# EAGLE design node_td (EAGLE 6.4)
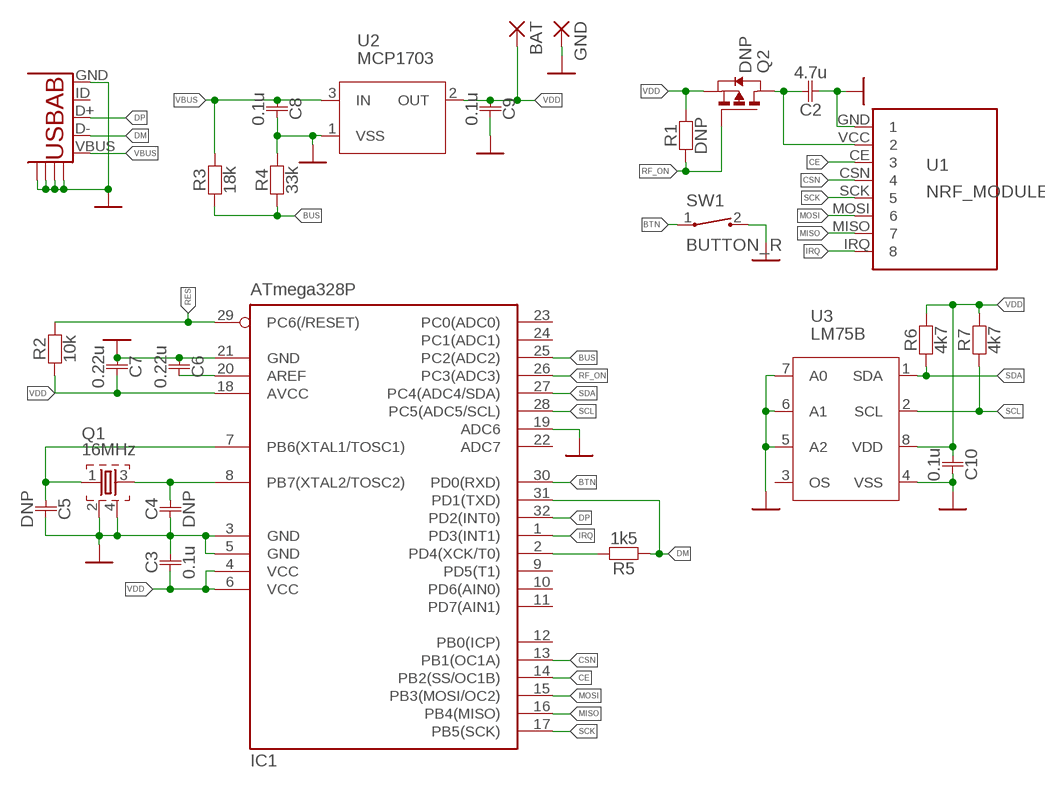
[diagram p0: schematic, sheet 1]

## Parts
BAT  WIREPAD1,6/0,9  [1,6/0,9]
C2  4.7u  C0805  [0805]
C3  0.1u  C0402  [0402]
C4  DNP  C0402  [0402]
C5  DNP  C0402  [0402]
C6  0.22u  C0402  [0402]
C7  0.22u  C0402  [0402]
C8  0.1u  C0402  [0402]
C9  0.1u  C0402  [0402]
C10  0.1u  C0402  [0402]
GND  WIREPAD1,6/0,9  [1,6/0,9]
IC1  ATmega328P  MEGA8-AI  [TQFP32-08]
Q1  16MHz  FA-3225  [FA-20H]
Q2  DNP  P-CHANNEL  [SOT23]
R1  DNP  R0402  [0402]
R2  10k  R0402  [0402]
R3  18k  R0402  [0402]
R4  33k  R0402  [0402]
R5  1k5  R0402  [0402]
R6  4k7  R0402  [0402]
R7  4k7  R0402  [0402]
SW1  BUTTON_R  [BUTTON_1]
U1  NRF_MODULE  [NRF_MODULE]
U2  MCP1703  [SOT23]
U3  LM75B  LM75DP  [MSOP8]
U$1  UNTITLED_USB_AB  [USB-MICRO-MOD]

## Nets
BTN: IC1.30(PD0(RXD)) SW1.1
BUS: IC1.25(PC2(ADC2)) R3.P$1 R4.P$1
CE: IC1.14(PB2(SS/OC1B)) U1.CE
CSN: IC1.13(PB1(OC1A)) U1.CSN
DM: IC1.31(PD1(TXD)) R5.P$1 U$1.D-
DP: IC1.32(PD2(INT0)) U$1.D+
GND: C2.P$1 C3.P$2 C4.P$1 C5.P$2 C6.P$1 C7.P$1 C8.P$2 C9.P$2 C10.P$2 GND.1(P) IC1.3(GND) IC1.5(GND) IC1.19(ADC6) IC1.21(GND) Q1.2 Q1.4 R4.P$2 SW1.2 U1.GND U2.1(VSS) U3.4(VSS) U3.5(A2) U3.6(A1) U3.7(A0) U$1.GND U$1.GND@1 U$1.GND@2 U$1.GND@3 U$1.GND@4
IRQ: IC1.1(PD3(INT1)) U1.IRQ
MISO: IC1.16(PB4(MISO)) U1.MISO
MOSI: IC1.15(PB3(MOSI/OC2)) U1.MOSI
N$1: IC1.2(PD4(XCK/T0)) R5.P$2
N$2: C6.P$2 IC1.20(AREF)
N$3: C5.P$1 IC1.7(PB6(XTAL1/TOSC1)) Q1.1
N$4: C4.P$2 IC1.8(PB7(XTAL2/TOSC2)) Q1.3
N$7: C2.P$2 Q2.3(D) U1.VCC
RES: IC1.29(PC6(/RESET)) R2.P$2
RF_ON: IC1.26(PC3(ADC3)) Q2.1(G) R1.P$1
SCK: IC1.17(PB5(SCK)) U1.SCK
SCL: IC1.28(PC5(ADC5/SCL)) R7.P$1 U3.2(SCL)
SDA: IC1.27(PC4(ADC4/SDA)) R6.P$1 U3.1(SDA)
VBUS: C8.P$1 R3.P$2 U2.3(IN) U$1.VBUS
VDD: BAT.1(P) C3.P$1 C7.P$2 C9.P$1 C10.P$1 IC1.4(VCC) IC1.6(VCC) IC1.18(AVCC) Q2.2(S) R1.P$2 R2.P$1 R6.P$2 R7.P$2 U2.2(OUT) U3.8(VDD)
Unconnected: IC1.9(PD5(T1)) IC1.10(PD6(AIN0)) IC1.11(PD7(AIN1)) IC1.12(PB0(ICP)) IC1.22(ADC7) IC1.23(PC0(ADC0)) IC1.24(PC1(ADC1)) U3.3(OS) U$1.ID(USBID)

## Library data of the parts
BAT GND = wirepad:WIREPAD: Wire PAD connect wire on PCB
C2-C10 = copter:C
IC1 = atmel:MEGA8: MICROCONTROLLER 8 Kbytes FLASH, 1 kbytes SRAM, 512 bytes EEPROM, USART, 6-channel 10 bit ADC, 2-channel 8 bit ADC Pin compatible with Atmega48, ATMega88, ATMega168 Source: avr.lbr; MPN: ATMEGA8-16AU; OC_FARNELL: 9171371; OC_NEWARK: 73M8863
Q1 = RLC:FA-: MHz RANGE CRYSTAL UNIT Source: Epson Toyocom
Q2 = cm-a20:P-CHANNEL
R1-R7 = copter:R
SW1 = RLC:BUTTON: CT10 Series Molded Switch Source: www.cotorelay.com .. Coto_Technology__CT10-1530-G1.pdf
U1 = nrf24L01:NRF_MODULE
U2 = thermo:MCP1703
U3 = thermo:LM75
U$1 = lb:UNTITLED_USB_AB: This is a USB AB connector that is compatible with USB OTG. i.e. this connector can serve as a host or device

## Board
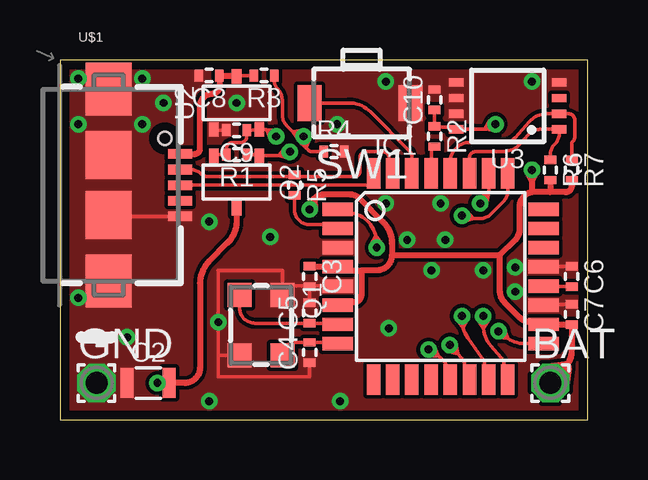
[diagram p1: board, top side]
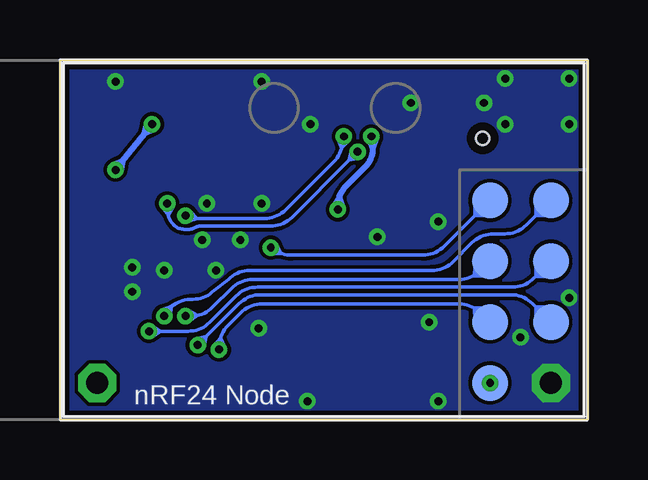
[diagram p2: board, bottom side, seen from below]

Size 22 x 15 mm. Coordinates in mm from the lower left corner, seen from the top.
Outline: 0,0 22,0 22,15 0,15 0,0
Copper layers (1*16): Top 0.0356mm / dielectric 1.5011mm / Bottom 0.0356mm
Design rules "oshpark-2layer": minimum track width 6mil, minimum drill 13mil, track to track 6mil, track to pad 6mil, pad to pad 6mil, via to via 6mil, smd to smd 6mil, copper to edge 15mil, drill to drill 6mil, minimum pad ring 7mil, minimum via ring 7mil, stop-mask expansion 0mil, vias tented up to drill 30mil, thermal gap 10mil

### Footprints (pad centres in the part's own frame; a part is rotated, then mirrored left to right if it is on the bottom)
1,6/0,9 = drill 0.914 pad 1.6 octagon: 1 0,0
0805 = smd 0.55 x 1.25: P$1 -0.875,0; P$2 0.875,0
0402 = smd 0.35 x 0.5: P$1 -0.425,0; P$2 0.425,0
TQFP32-08 = smd 1.27 x 0.559: 1 -4.293,2.8; 2 -4.293,2; 3 -4.293,1.2; 4 -4.293,0.4; 5 -4.293,-0.4; 6 -4.293,-1.2; 7 -4.293,-2; 8 -4.293,-2.8; 17 4.293,-2.8; 18 4.293,-2; 19 4.293,-1.2; 20 4.293,-0.4; 21 4.293,0.4; 22 4.293,1.2; 23 4.293,2; 24 4.293,2.8 | smd 0.559 x 1.27: 9 -2.8,-4.293; 10 -2,-4.293; 11 -1.2,-4.293; 12 -0.4,-4.293; 13 0.4,-4.293; 14 1.2,-4.293; 15 2,-4.293; 16 2.8,-4.293; 25 2.8,4.293; 26 2,4.293; 27 1.2,4.293; 28 0.4,4.293; 29 -0.4,4.293; 30 -1.2,4.293; 31 -2,4.293; 32 -2.8,4.293
FA-20H = smd 1 x 1: 1 -1.27,-0.889; 2 1.27,-0.889; 3 1.27,0.889; 4 -1.27,0.889
SOT23 = smd 0.4 x 0.6: 1 -0.95,-1.1; 2 0.95,-1.1; 3 0,1.1
BUTTON_1 = smd 1 x 1.5: 1 -2.159,0; 2 2.032,0
NRF_MODULE = smd 1.5 x 1.5: CE -1.524,4.064; CSN -4.064,4.064; GND -1.524,1.524; IRQ -4.064,9.144; MISO -1.524,9.144; MOSI -4.064,6.604; SCK -1.524,6.604; VCC -4.064,1.524
MSOP8 = smd 0.35 x 0.6: 1 -0.975,-2.152; 2 -0.325,-2.152; 3 0.325,-2.152; 4 0.975,-2.152; 5 0.975,2.152; 6 0.325,2.152; 7 -0.325,2.152; 8 -0.975,2.152
USB-MICRO-MOD = smd 1 x 0.4: D+ 2.469,0; D- 2.469,0.65; GND 2.469,-1.3; ID 2.469,-0.65; VBUS 2.469,1.3 | smd 1.9 x 2.2: GND@1 -0.508,4; GND@4 -0.508,-4 | smd 1.9 x 2: GND@2 -0.508,1.25; GND@3 -0.508,-1.25 | hole 0.55: 1.84,1.95

### Placement (x,y rotation side)
BAT  20.45,1.52 0 top
C2  3.68,1.52 0 top
C3  10.41,5.97 270 top
C4  10.41,2.79 90 top
C5  10.41,4.45 90 top
C6  21.34,5.97 270 top
C7  21.34,4.38 270 top
C8  6.22,14.35 180 top
C9  7.37,12.06 180 top
C10  15.62,13.34 90 top
GND  1.52,1.52 0 top
IC1  15.88,5.97 0 top
Q1  8.38,3.94 270 top
Q2  7.37,9.91 180 top
R1  7.37,11.05 180 top
R2  15.62,11.81 270 top
R3  8.51,14.35 180 top
R4  11.43,11.18 0 top
R5  9.78,9.78 270 top
R6  20.45,10.41 270 top
R7  21.34,10.41 270 top
SW1  12.57,13.21 0 top
U1  0,0 0 bottom
U2  7.37,13.21 0 top
U3  18.67,13.08 90 top
U$1  2.54,9.78 0 top

### Tracks (layer width: path | path; a pad name or v marks a point on that pad's centre or on a via)
BTN
  Top 0.152: SW1.1 12.05,13.21 arc-45 12.95,12.84 14.58,11.2 arc-45 14.68,10.97 IC1.30
BUS  (via drill 0.33 pad 0.53)
  Top 0.152: R3.P$1 8.93,14.14 arc45 9.09,13.78 arc-45 9.27,13.33 9.27,12.71 arc45 9.46,12.26 9.71,12.01 | 9.71,12.01 9.91,11.81 v10.16,11.81 | R4.P$1 10.52,11.18 arc-45 10.34,11.25 10.26,11.33 | 10.26,11.33 10.23,11.36 arc-45 10.16,11.54 v10.16,11.81 | IC1.25 18.68,9.54 arc-45 18.49,9.09 17.97,8.57 arc-45 17.52,8.38 17.24,8.38 | 17.24,8.38 16.89,8.38 v16.76,8.51 | 9.71,12.01 9.94,11.66 v10.16,11.81 | 9.71,12.01 10.12,12.07 v10.16,11.81 | 10.26,11.33 10.41,11.72 v10.16,11.81 | 10.26,11.33 9.97,11.62 v10.16,11.81 | 17.24,8.38 16.96,8.69 v16.76,8.51 | 17.24,8.38 16.84,8.26 v16.76,8.51
  Bottom 0.152: v16.76,8.51 16.64,8.38 16.29,8.38 | 16.29,8.38 13.48,8.38 arc-45 12.58,8.75 10.6,10.74 arc-45 10.22,11.64 10.22,11.75 v10.16,11.81 | v10.16,11.81 10.41,11.72 10.26,11.33 9.97,11.62 v10.16,11.81 | 16.29,8.38 16.68,8.26 v16.76,8.51 | 16.29,8.38 16.57,8.69 v16.76,8.51
CE  (via drill 0.33 pad 0.53)
  Top 0.152: IC1.14 16.89,1.68 16.89,2.17 arc42 16.73,2.6 16.59,2.75 | 16.59,2.75 v16.26,3.11 | 16.59,2.75 16.52,3.16 v16.26,3.11 | 16.59,2.75 16.19,2.85 v16.26,3.11
  Bottom 0.152: U1.CE 2.16,4.7 | 2.16,4.7 2.29,4.83 arc-45 3.19,5.21 13.63,5.21 arc-45 14.53,4.83 15.91,3.46 | 15.91,3.46 v16.26,3.11 | 15.91,3.46 16,3.05 v16.26,3.11 | 15.91,3.46 16.31,3.37 v16.26,3.11 | 2.16,4.7 1.65,4.7 2.16,4.19 2.16,4.7
CSN  (via drill 0.33 pad 0.53)
  Top 0.152: IC1.13 16.13,1.82 16.13,2.07 arc56 15.85,2.6 v15.37,2.92 | v15.37,2.92 15.61,3.03 15.78,2.65 15.36,2.65 v15.37,2.92
  Bottom 0.152: U1.CSN 4.45,4.45 | 4.45,4.45 arc-45 5.35,4.83 13.57,4.83 arc-45 14.47,4.45 14.99,3.93 arc-45 15.37,3.03 v15.37,2.92 | v15.37,2.92 15.13,3.04 15.31,3.41 15.57,3.09 v15.37,2.92 | 4.45,4.45 4.7,4.14 4.72,4.65 4.17,4.67 4.34,4.37
DM
  Top 0.152: IC1.31 13.72,10.26 13.72,10.92 arc90 13.46,11.18 12.76,11.18 arc90 12.51,10.92 12.51,10.35 arc-90 12.3,10.14 9.65,10.14 | 9.65,10.14 R5.P$1 | 9.65,10.14 6.13,10.14 arc-45 5.89,10.24 arc45 5.44,10.43 U$1.D-
DP
  Top 0.152: U$1.D+ 13.07,9.78 IC1.32
GND  (via drill 0.33 pad 0.53)
  Top 0.152: C9.P$2 6.46,12.06 arc-90 U2.1 | IC1.5 10.41,5.57 | 10.41,5.57 C3.P$2 C5.P$2 | 10.41,5.57 9.27,5.57 Q1.4 9.27,6.22 6.6,6.22 6.6,2.67 | C6.P$1 20.17,6.39 | 20.17,6.39 IC1.21 | 20.17,6.39 20.12,6.35 | C7.P$1 20.17,4.81 IC1.19 | 6.6,2.67 6.6,1.78 10.41,1.78 C4.P$1 | Q1.2 6.6,2.67 | U$1.GND 2.08,8.48 U$1.GND@3
  other vias: 17.65,6.22 7.37,13.21 4.32,13.21 19.68,14.1 13.59,14.1 11.68,0.76 6.22,0.76 0.76,14.22 3.43,14.22 3.43,12.32 0.76,12.32 2.79,3.43 0.76,5.08 11.56,12.32 18.99,5.33 18.99,6.35 13.59,9.02 15.88,9.02 14.48,7.49 16.07,7.49 15.49,6.22 6.6,4.06 6.22,8.26 8.76,7.62 13.72,3.81
  pour Bottom (rank 6, no thermals): 0.13,14.86 21.84,14.86 21.84,0.13 0.13,0.13
  pour Top (no thermals): 0.13,14.86 21.84,14.86 21.84,0.13 0.13,0.13
IRQ  (via drill 0.33 pad 0.53)
  Top 0.152: IC1.1 11.71,8.64 11.94,8.64 arc-90 13.21,7.37 v13.21,7.18 | v13.21,7.18 12.97,7.3 13.17,7.67 13.42,7.33 v13.21,7.18
  Bottom 0.152: U1.IRQ 4.7,8.51 | 4.7,8.51 5.98,7.23 arc45 6.88,6.86 12.34,6.86 arc32 13.01,7.05 v13.21,7.18 | v13.21,7.18 13.19,6.91 12.77,6.94 12.97,7.3 v13.21,7.18 | 4.7,8.51 4.7,9.02 arc270 4.19,8.51 4.7,8.51
MISO  (via drill 0.33 pad 0.53)
  Top 0.152: IC1.16 18.54,1.68 18.54,2.17 arc41 18.39,2.59 17.97,3.07 arc-41 17.65,3.91 v17.65,4.32 | v17.65,4.32 17.88,4.18 17.66,3.82 17.43,4.17 v17.65,4.32
  Bottom 0.152: U1.MISO 2.16,8.51 | 2.16,8.51 2.55,8.12 arc45 3.45,7.75 3.92,7.75 arc-45 4.82,7.38 5.6,6.59 arc45 6.5,6.22 14.08,6.22 arc-45 14.98,5.85 15.57,5.39 arc45 16.46,5.02 16.55,5.02 arc-34 17.36,4.72 | v17.65,4.32 17.58,4.52 arc11 17.36,4.72 | 17.36,4.72 17.39,4.3 v17.65,4.32 | 17.36,4.72 17.75,4.57 v17.65,4.32 | 2.16,8.51 1.52,8.51 arc-217 2.16,9.02 2.16,8.51
MOSI  (via drill 0.33 pad 0.53)
  Top 0.152: IC1.15 17.72,1.68 17.72,2.21 arc36 17.6,2.58 17,3.42 arc-36 16.76,4.15 v16.76,4.32 | v16.76,4.32 17,4.2 16.81,3.83 16.55,4.16 v16.76,4.32
  Bottom 0.152: U1.MOSI 4.45,6.21 | 4.45,6.21 arc45 5.35,5.84 13.95,5.84 arc-45 14.85,5.47 15.63,4.69 arc45 16.53,4.32 v16.76,4.32 | v16.76,4.32 16.61,4.1 16.27,4.34 16.63,4.55 v16.76,4.32 | 4.45,6.21 4.24,5.97 4.75,5.99 4.67,6.4
N$1
  Top 0.152: IC1.2 11.42,8.13 10.41,8.13 arc-90 9.78,8.76 R5.P$2
N$2
  Top 0.152: C6.P$2 20.17,5.54 IC1.20
N$3
  Top 0.152: IC1.7 11.58,4.02 C5.P$1 8.13,4.02 arc-90 7.49,4.66 Q1.1
N$4
  Top 0.152: IC1.8 11.58,3.22 C4.P$2 9.82,3.22 arc90 Q1.3
N$7  (via drill 0.33 pad 0.53)
  Top 0.152: C2.P$2 4.56,1.54
  Top 0.254: Q2.3 7.37,8.27 arc-45 6.99,7.38 6.21,6.59 arc45 5.84,5.7 5.84,2.17 arc-45 5.66,1.72 5.65,1.71 arc-45 5.2,1.52 C2.P$2 | C2.P$2 | 4.56,1.54 U1.VCC | C2.P$2 4.16,1.72 U1.VCC | C2.P$2 4.16,1.33 U1.VCC
  other vias: 4.06,1.52
RES
  Top 0.152: R2.P$2 15.49,11.26 15.49,10.26 IC1.29
RF_ON  (via drill 0.33 pad 0.53)
  Top 0.152: R1.P$1 8.32,11.05 Q2.1 9.12,11.01 | 9.12,11.01 9.31,11.01 arc45 9.49,11.08 v9.59,11.18 | IC1.26 17.88,9.5 arc-45 17.78,9.27 v17.53,9.02 | 9.12,11.01 9.53,10.92 v9.59,11.18 | 9.12,11.01 9.38,11.34 v9.59,11.18 | v17.53,9.02 17.45,9.27 17.86,9.39 17.79,8.97 v17.53,9.02
  Bottom 0.152: v17.53,9.02 17.53,8.8 arc-16 17.49,8.52 | 17.49,8.52 arc-29 17.23,8.09 17.27,8.12 arc-45 16.82,7.94 16.59,7.94 arc-27 16.44,7.97 16.32,8.03 arc27 16.18,8.06 13.23,8.06 arc-45 12.33,8.44 9.94,10.83 | 9.94,10.83 v9.59,11.18 | 9.94,10.83 9.85,11.23 v9.59,11.18 | 9.94,10.83 9.53,10.92 v9.59,11.18 | 17.49,8.52 17.74,8.86 v17.53,9.02 | 17.49,8.52 17.29,8.89 v17.53,9.02
SCK  (via drill 0.33 pad 0.53)
  Top 0.152: v18.29,3.68 18.58,3.45 arc39 19.38,3.17 IC1.17 | v18.29,3.68 18.54,3.77 18.68,3.38 18.26,3.42 v18.29,3.68
  Bottom 0.152: U1.SCK 2.16,5.97 | 2.16,5.97 2.23,5.9 arc45 3.13,5.52 13.76,5.52 arc-45 14.66,5.15 15.76,4.05 arc45 16.66,3.68 17.79,3.68 | v18.29,3.68 17.79,3.68 | 17.79,3.68 18.14,3.46 v18.29,3.68 | 17.79,3.68 18.14,3.91 v18.29,3.68 | 2.16,5.97 1.65,5.97 2.16,6.48 2.16,5.97
SCL
  Top 0.152: R7.P$1 21.34,11.48 arc-45 21.39,11.61 arc45 21.46,11.79 21.46,12.5 arc90 21.21,12.76 U3.2 20.32,12.76 arc48 19.57,12.42 18.98,11.77 arc-48 18.51,11.56 17.03,11.56 arc45 16.58,11.37 16.46,11.25 arc45 16.27,10.8 IC1.28
SDA
  Top 0.152: R6.P$1 20.45,11.04 arc-45 20.63,11.49 20.64,11.5 arc45 20.83,11.95 20.83,11.97 U3.1 20.02,12.11 arc49 19.54,11.89 19.22,11.52 arc-49 18.46,11.18 17.33,11.18 arc90 17.07,10.92 IC1.27
VBUS
  Top 0.152: R3.P$2 7.41,14.35 | 7.32,14.35 U2.3
  Top 0.254: 7.41,14.35 U2.3 | 7.32,14.35 C8.P$1 6.65,13.89 arc-90 6.35,13.59 arc90 5.84,13.08 5.84,11.3 arc-90 5.62,11.08 U$1.VBUS
VDD  (via drill 0.33 pad 0.53)
  Top 0.152: Q2.2 arc-90 6.46,11.05 R1.P$2 6.94,11.3 arc-90 7.2,11.56 7.54,11.56 arc90 7.79,11.81 C9.P$1 8.27,12.06 arc90 U2.2 8.46,12.11 arc-45 8.91,11.92 v9.02,11.81 | 11.58,6.39 IC1.4 11.58,6.22 | 20.17,3.96 IC1.18 20.17,4.06 | C10.P$1 R2.P$1 15.62,12.19 16.52,12.19 U3.8 17.71,12.11 | 17.71,12.11 17.95,12.11 v18.16,12.32 | IC1.6 11.58,4.89 | v9.02,11.81 8.77,11.71 8.61,12.09 9.03,12.08 v9.02,11.81 | 17.71,12.11 18.13,12.05 v18.16,12.32 | 17.71,12.11 17.93,12.46 v18.16,12.32
  Top 0.254: C3.P$1 11.58,6.39 | 20.17,3.96 C7.P$2 21.34,2.94 arc-45 20.96,2.04 BAT.1 | R7.P$2 21.34,9.73 arc-90 21.08,9.48 20.45,9.48 | 20.45,9.48 19.68,9.48 | R6.P$2 20.45,9.48 | v19.68,10.41 19.68,9.92 | 19.68,9.92 19.68,9.48 | 20.17,4.06 19.63,4.06 arc-45 19.18,4.25 18.54,4.89 arc-45 18.35,5.34 18.35,6.86 | 18.35,6.86 18.99,7.5 arc45 19.18,7.95 19.18,8.88 arc-45 19.36,9.33 19.39,9.36 arc-45 19.68,9.48 | 12.57,6.22 12.57,5.21 arc-90 12.26,4.89 11.58,4.89 | 11.58,6.22 12.57,6.22 | v10.41,8.76 arc-90 11.05,9.4 12.06,9.4 arc-45 12.51,9.21 13.47,8.25 arc-45 13.84,7.35 13.84,6.86 | 13.84,6.86 arc-90 13.21,6.22 12.57,6.22 | 13.84,6.86 18.35,6.86 | v10.41,8.76 10.27,8.93 10.61,9.22 10.63,8.77 v10.41,8.76 | 19.68,9.92 19.88,10.32 v19.68,10.41 | 19.68,9.92 19.49,10.32 v19.68,10.41
  Top 0.508: 21.08,2.18 20.36,2.06 BAT.1 20.99,1.45 21.08,2.18
  Bottom 0.254: v10.41,8.76 10.41,8.87 arc45 10.04,9.77 9.25,10.57 arc-45 8.95,11.27 8.95,11.32 | 8.95,11.32 8.95,11.75 v9.02,11.81 | v19.68,10.41 19.38,10.8 | 19.38,10.8 18.47,11.93 | 18.47,11.93 v18.16,12.32 | 8.95,11.32 9.07,11.69 v9.02,11.81 | 8.95,11.32 8.81,11.74 v9.02,11.81 | v10.41,8.76 10.21,8.83 10.36,9.26 10.6,8.88 v10.41,8.76 | 18.47,11.93 18.37,12.37 v18.16,12.32 | 18.47,11.93 18.07,12.12 v18.16,12.32 | 19.38,10.8 19.47,10.37 v19.68,10.41 | 19.38,10.8 19.78,10.61 v19.68,10.41

### Text on the board
_bPlace: nRF24 Node